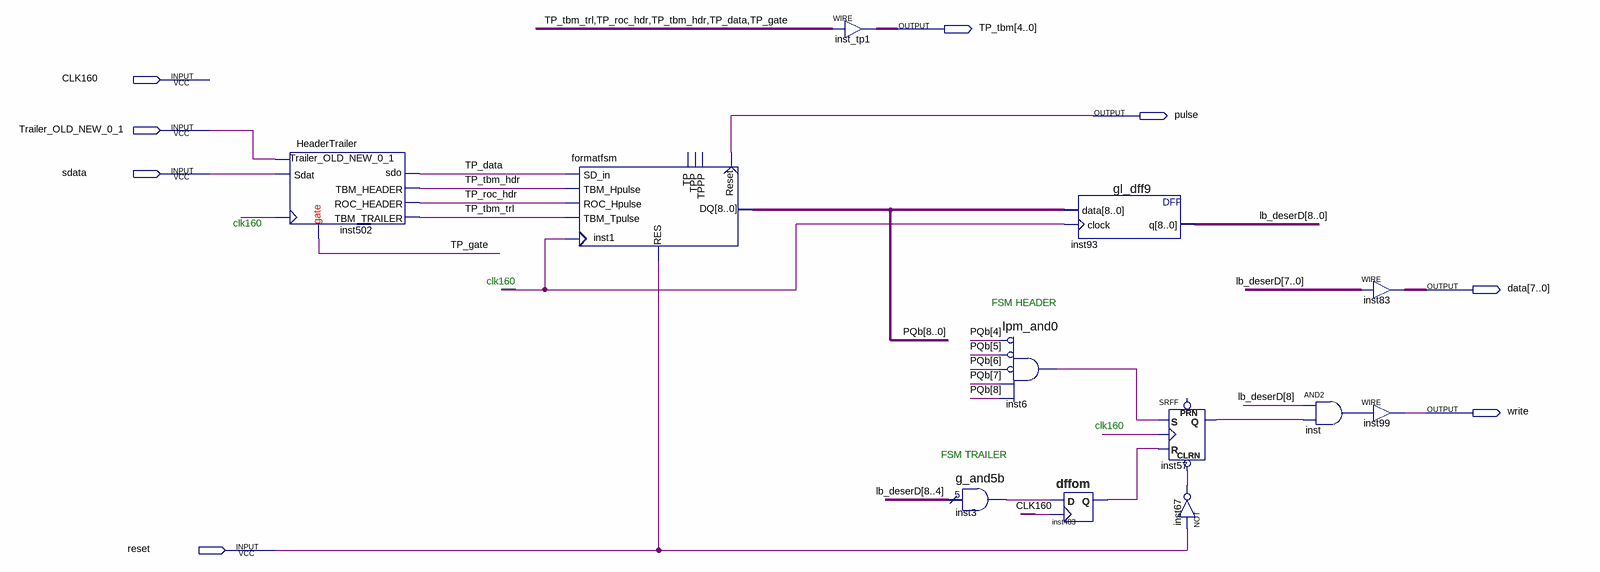
[diagram p0: schematic sheet]
// Quartus schematic TBM_decoder.bdf as structural Verilog: 12 symbols, 8 pins
module TBM_decoder (
  input  CLK160,
  input  Trailer_OLD_NEW_0_1,
  input  sdata,
  input  reset,
  output [4:0] TP_tbm,
  output pulse,
  output [7:0] data,
  output write
);

  wire inst3_result, inst6_result, inst57_q, inst67_out, inst483_q, inst_out, TP_data, TP_gate, TP_roc_hdr,
       TP_tbm_hdr, TP_tbm_trl;
  wire [8:0] lb_deserD, PQb;

  HeaderTrailer inst502 (
    .Sdat(sdata), .CLK(CLK160), .Trailer_OLD_NEW_0_1(Trailer_OLD_NEW_0_1), .TBM_HEADER(TP_tbm_hdr),
    .ROC_HEADER(TP_roc_hdr), .TBM_TRAILER(TP_tbm_trl), .sdo(TP_data), .gate(TP_gate));
  formatfsm inst1 (
    .TBM_Hpulse(TP_tbm_hdr), .ROC_Hpulse(TP_roc_hdr), .TBM_Tpulse(TP_tbm_trl), .SD_in(TP_data), .RES(reset),
    .CLK160(CLK160), .DQ(PQb), .Reset(pulse));  // open: TPPP, TPP, TP
  assign TP_tbm = {TP_tbm_trl, TP_roc_hdr, TP_tbm_hdr, TP_data, TP_gate};  // WIRE inst_tp1
  g_and5b inst3 (.data(lb_deserD[8:4]), .result(inst3_result));
  lpm_and0 inst6 (
    .data0(~PQb[4]), .data1(~PQb[5]), .data2(~PQb[6]), .data3(PQb[7]), .data4(PQb[8]), .result(inst6_result));
  gl_dff9 inst93 (.data(PQb), .clock(CLK160), .q(lb_deserD));
  dffom inst483 (.D(inst3_result), .CK(CLK160), .Q(inst483_q));
  SRFF inst57 (.CLRN(inst67_out), .S(inst6_result), .R(inst483_q), .CLK(CLK160), .Q(inst57_q));  // open: PRN
  not inst67 (inst67_out, reset);
  and inst (inst_out, lb_deserD[8], inst57_q);
  assign data = lb_deserD[7:0];  // WIRE inst83
  assign write = inst_out;  // WIRE inst99

  // Notes on the sheet:
  //   FSM HEADER
  //   FSM TRAILER
endmodule
